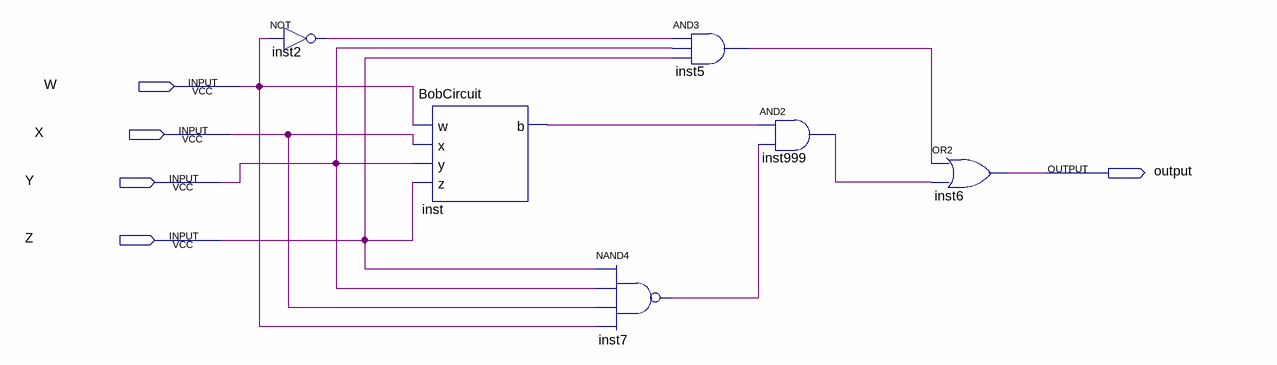
[diagram p0: schematic sheet]
// Quartus schematic FunctionalBob.bdf as structural Verilog: 6 symbols, 5 pins
module FunctionalBob (
  input  W,
  input  X,
  input  Y,
  input  Z,
  output \output 
);

  wire inst2_out, inst5_out, inst7_out, inst999_out, inst_b;

  not inst2 (inst2_out, W);
  BobCircuit inst (.w(W), .x(X), .y(Y), .z(Z), .b(inst_b));
  nand inst7 (inst7_out, Z, Y, X, W);
  and inst5 (inst5_out, inst2_out, Y, Z);
  and inst999 (inst999_out, inst_b, inst7_out);
  or inst6 (\output , inst5_out, inst999_out);
endmodule
